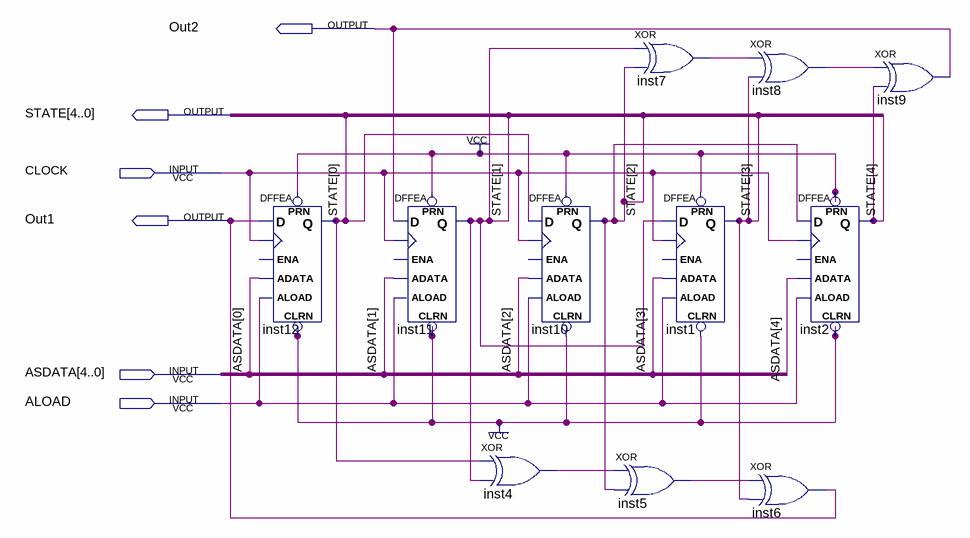
[diagram p0: schematic sheet]
// Quartus schematic Multi_MGenerator.bdf as structural Verilog: 11 symbols, 6 pins
module Multi_MGenerator (
  input  CLOCK,
  input  [4:0] ASDATA,
  input  ALOAD,
  output Out2,
  output [4:0] STATE,
  output Out1
);

  wire inst4_out, inst5_out, inst7_out, inst8_out;

  DFFEA inst12 (
    .PRN(1'b1), .ALOAD(ALOAD), .ADATA(ASDATA[0]), .CLK(CLOCK), .D(Out1), .CLRN(1'b1), .Q(STATE[0]));  // open: ENA
  DFFEA inst11 (
    .PRN(1'b1), .ALOAD(ALOAD), .ADATA(ASDATA[1]), .CLK(CLOCK), .D(Out2), .CLRN(1'b1), .Q(STATE[1]));  // open: ENA
  DFFEA inst10 (
    .PRN(1'b1), .ALOAD(ALOAD), .ADATA(ASDATA[2]), .CLK(CLOCK), .D(STATE[0]), .CLRN(1'b1), .Q(STATE[2]));  // open: ENA
  xor inst4 (inst4_out, STATE[0], STATE[1]);
  xor inst5 (inst5_out, inst4_out, STATE[2]);
  xor inst7 (inst7_out, STATE[1], STATE[2]);
  DFFEA inst1 (
    .PRN(1'b1), .ALOAD(ALOAD), .ADATA(ASDATA[3]), .CLK(CLOCK), .D(STATE[1]), .CLRN(1'b1), .Q(STATE[3]));  // open: ENA
  xor inst8 (inst8_out, inst7_out, STATE[3]);
  xor inst6 (Out1, inst5_out, STATE[3]);
  DFFEA inst2 (
    .PRN(1'b1), .ALOAD(ALOAD), .ADATA(ASDATA[4]), .CLK(CLOCK), .D(STATE[2]), .CLRN(1'b1), .Q(STATE[4]));  // open: ENA
  xor inst9 (Out2, inst8_out, STATE[4]);
endmodule
